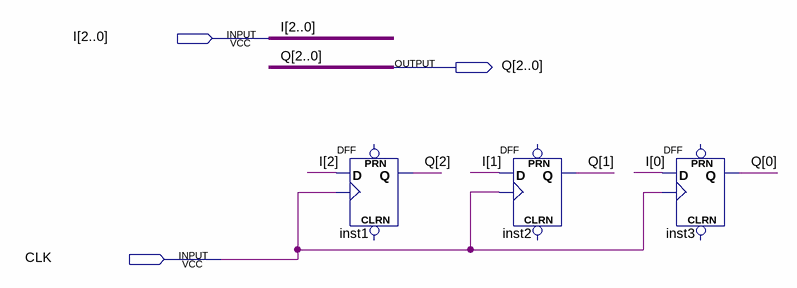
[diagram p0: schematic sheet]
// Quartus schematic Current_state.bdf as structural Verilog: 3 symbols, 3 pins
module Current_state (
  input  [2:0] I,
  input  CLK,
  output [2:0] Q
);

  DFF inst1 (.CLK(CLK), .D(I[2]), .Q(Q[2]));  // open: CLRN, PRN
  DFF inst2 (.CLK(CLK), .D(I[1]), .Q(Q[1]));  // open: CLRN, PRN
  DFF inst3 (.CLK(CLK), .D(I[0]), .Q(Q[0]));  // open: CLRN, PRN
endmodule
